# EasyEDA schematic SCH_LAMPU_LALU_LINTAS_1_JALUR.json
TITLE: LAMPU_LALU_LINTAS_1_JALUR; REV: 1.0; Date: 2024-10-13; Sheet: 1/1; Company: FAHMI IBRAHIM
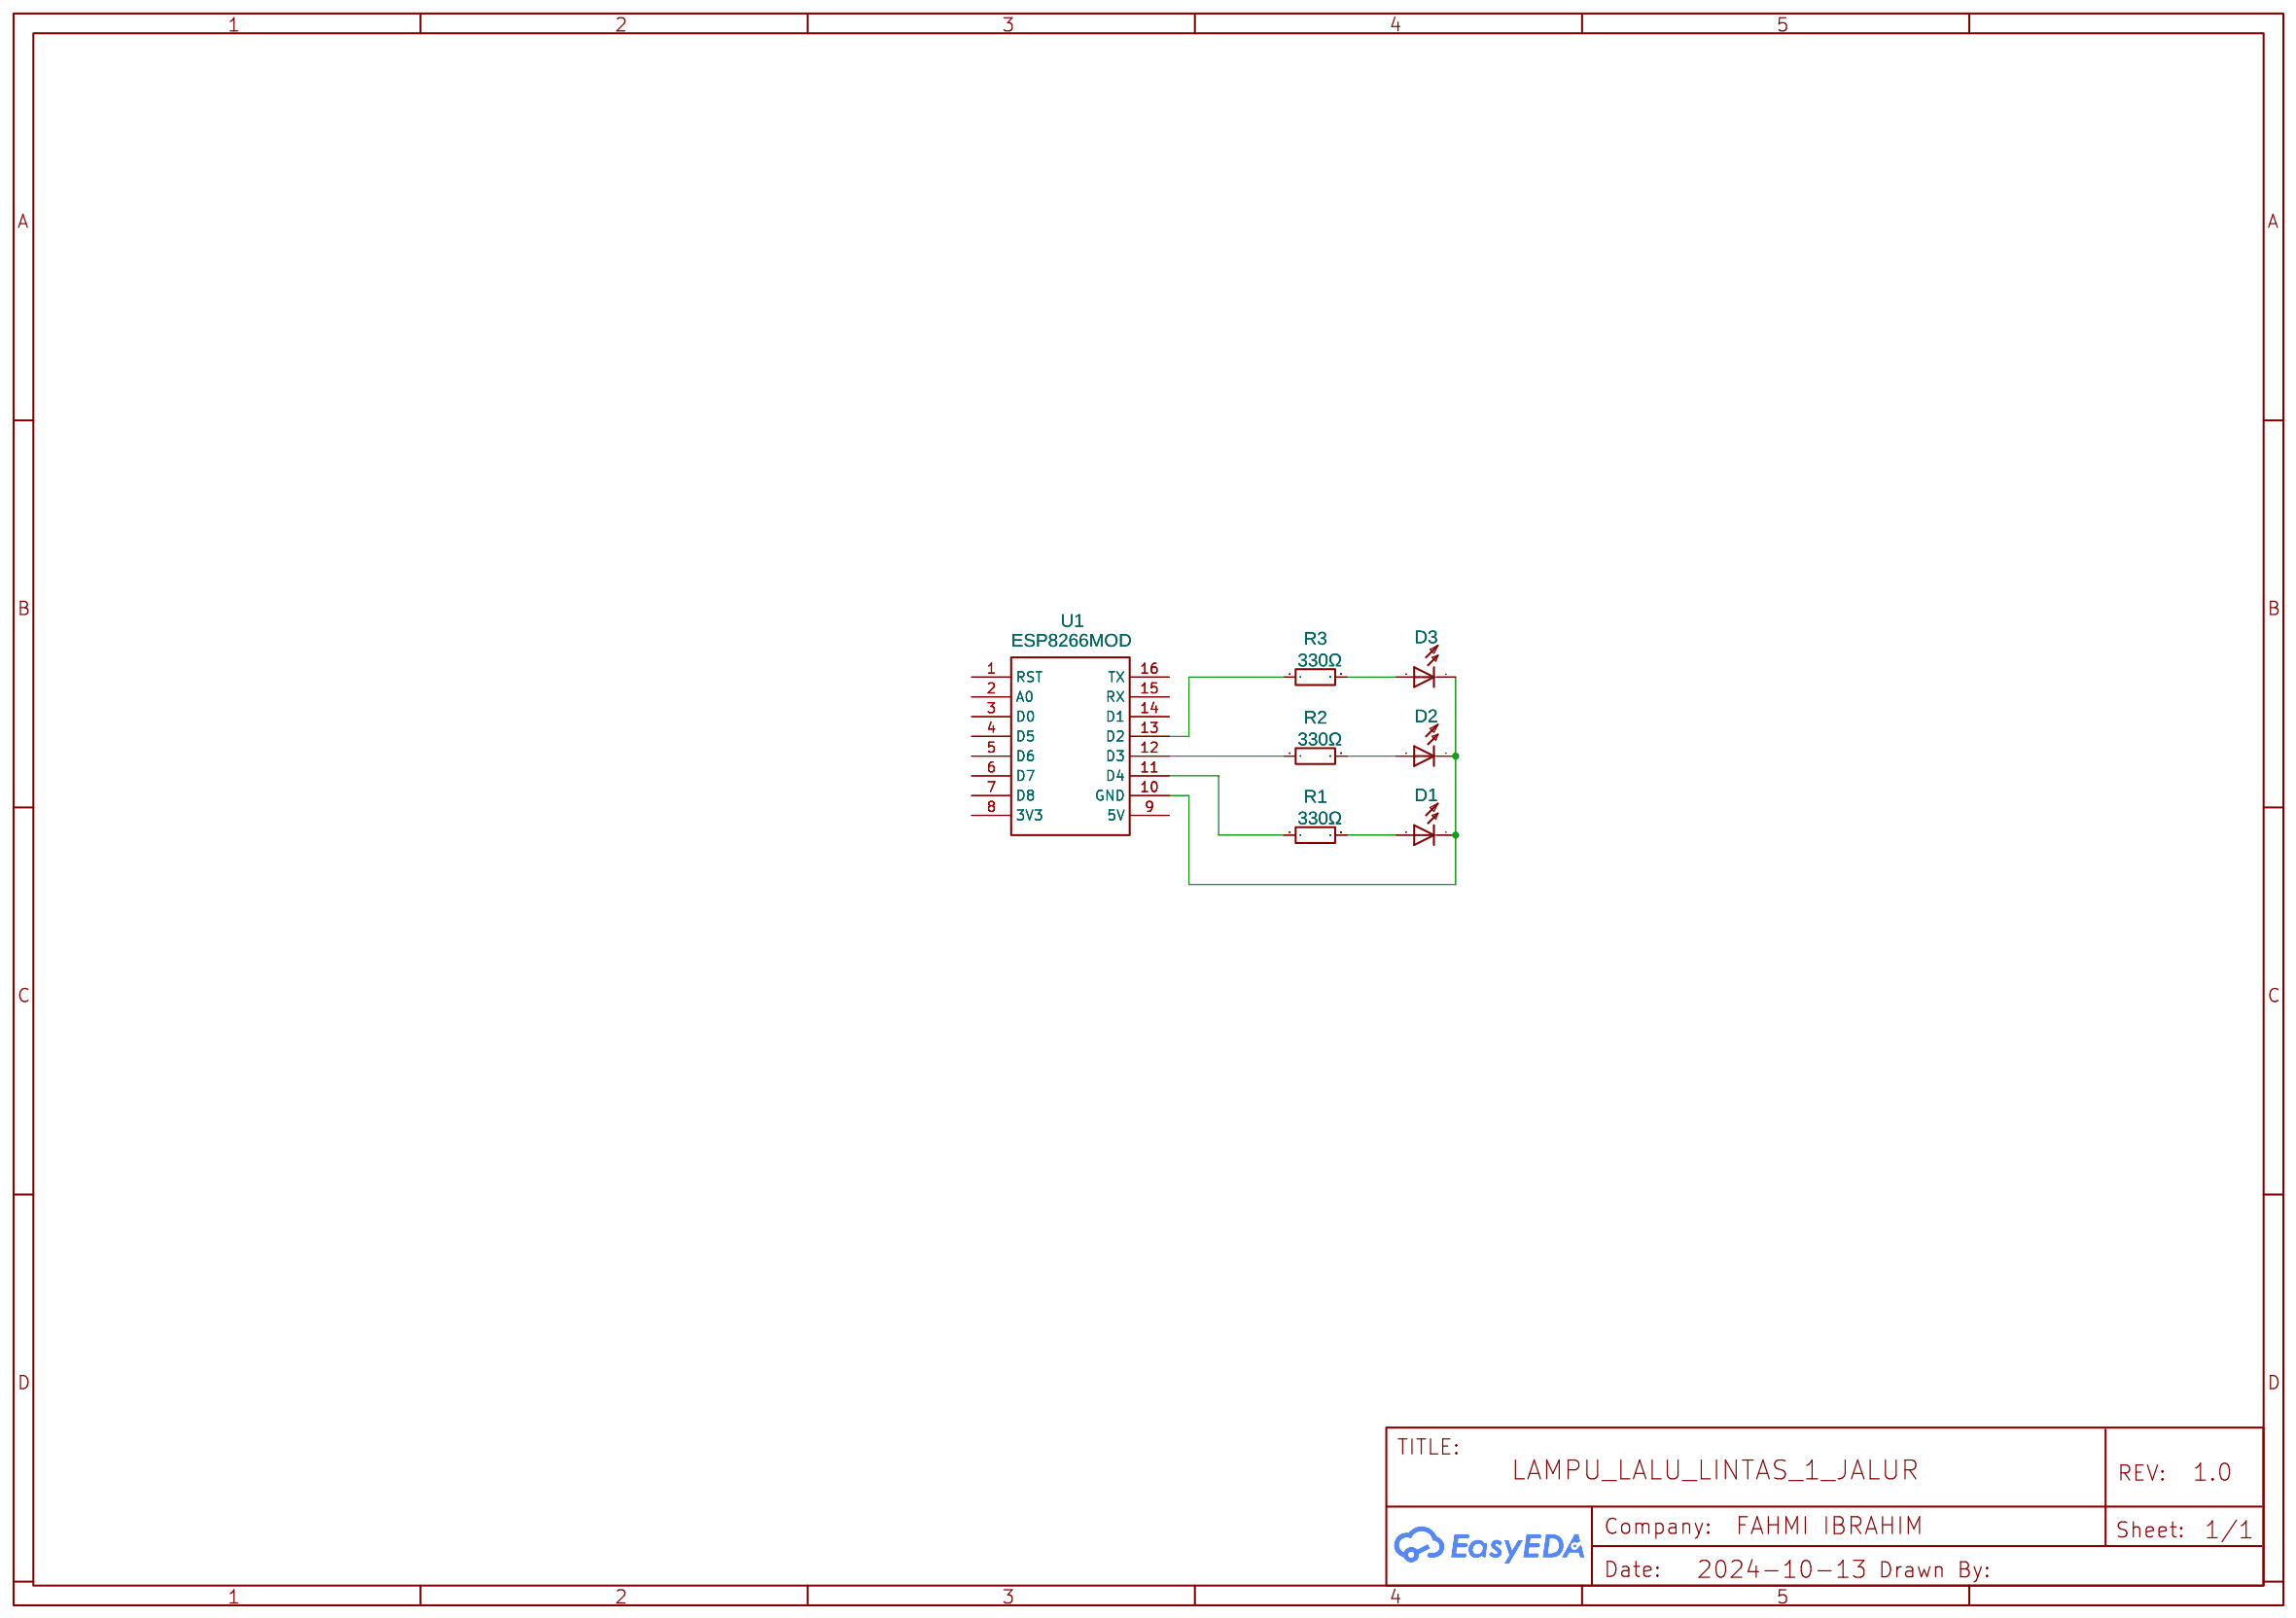
[diagram p0: schematic sheet]

## Parts
D1  RED  [LED_LED3MM]
D2  RED  [LED_LED3MM]
D3  RED  [LED_LED3MM]
R1  330Ω  [FIXED RESISTOR]
R2  330Ω  [FIXED RESISTOR]
R3  330Ω  [FIXED RESISTOR]
U1  ESP8266MOD  [ESP8266MOD]

## Library data of the parts
D1-D3 = LED 3 MM: Contributor: blizzbjm
R1-R3 = RESISTOR NORMAL: Supplier: LCSC; Supplier Part: X16151710; Manufacturer: ResistorToday; Manufacturer Part: EWWR0001J20R0T9; Contributor: MehmetCan94
U1 = ESP8266MOD: Supplier Part: aristotles; Contributor: aristotles

## Nets
Net-(D1-+): D1.+ R1.2
Net-(D1--): D1.- D2.- D3.- U1.10(GND)
Net-(D2-+): D2.+ R2.2
Net-(D3-+): D3.+ R3.2
Net-(R1-1): R1.1 U1.11(D4)
Net-(R2-1): R2.1 U1.12(D3)
Net-(R3-1): R3.1 U1.13(D2)

Not connected (* = marked no-connect by the designer): U1 1(RST) 2(A0) 3(D0) 4(D5) 5(D6) 6(D7) 7(D8) 8(3V3) 9(5V) 14(D1) 15(RX) 16(TX)
